# Altium schematic sheet [19] - USB.SchDoc
size A2; DocumentNumber: 19; SheetNumber: 19; SheetTotal: 31
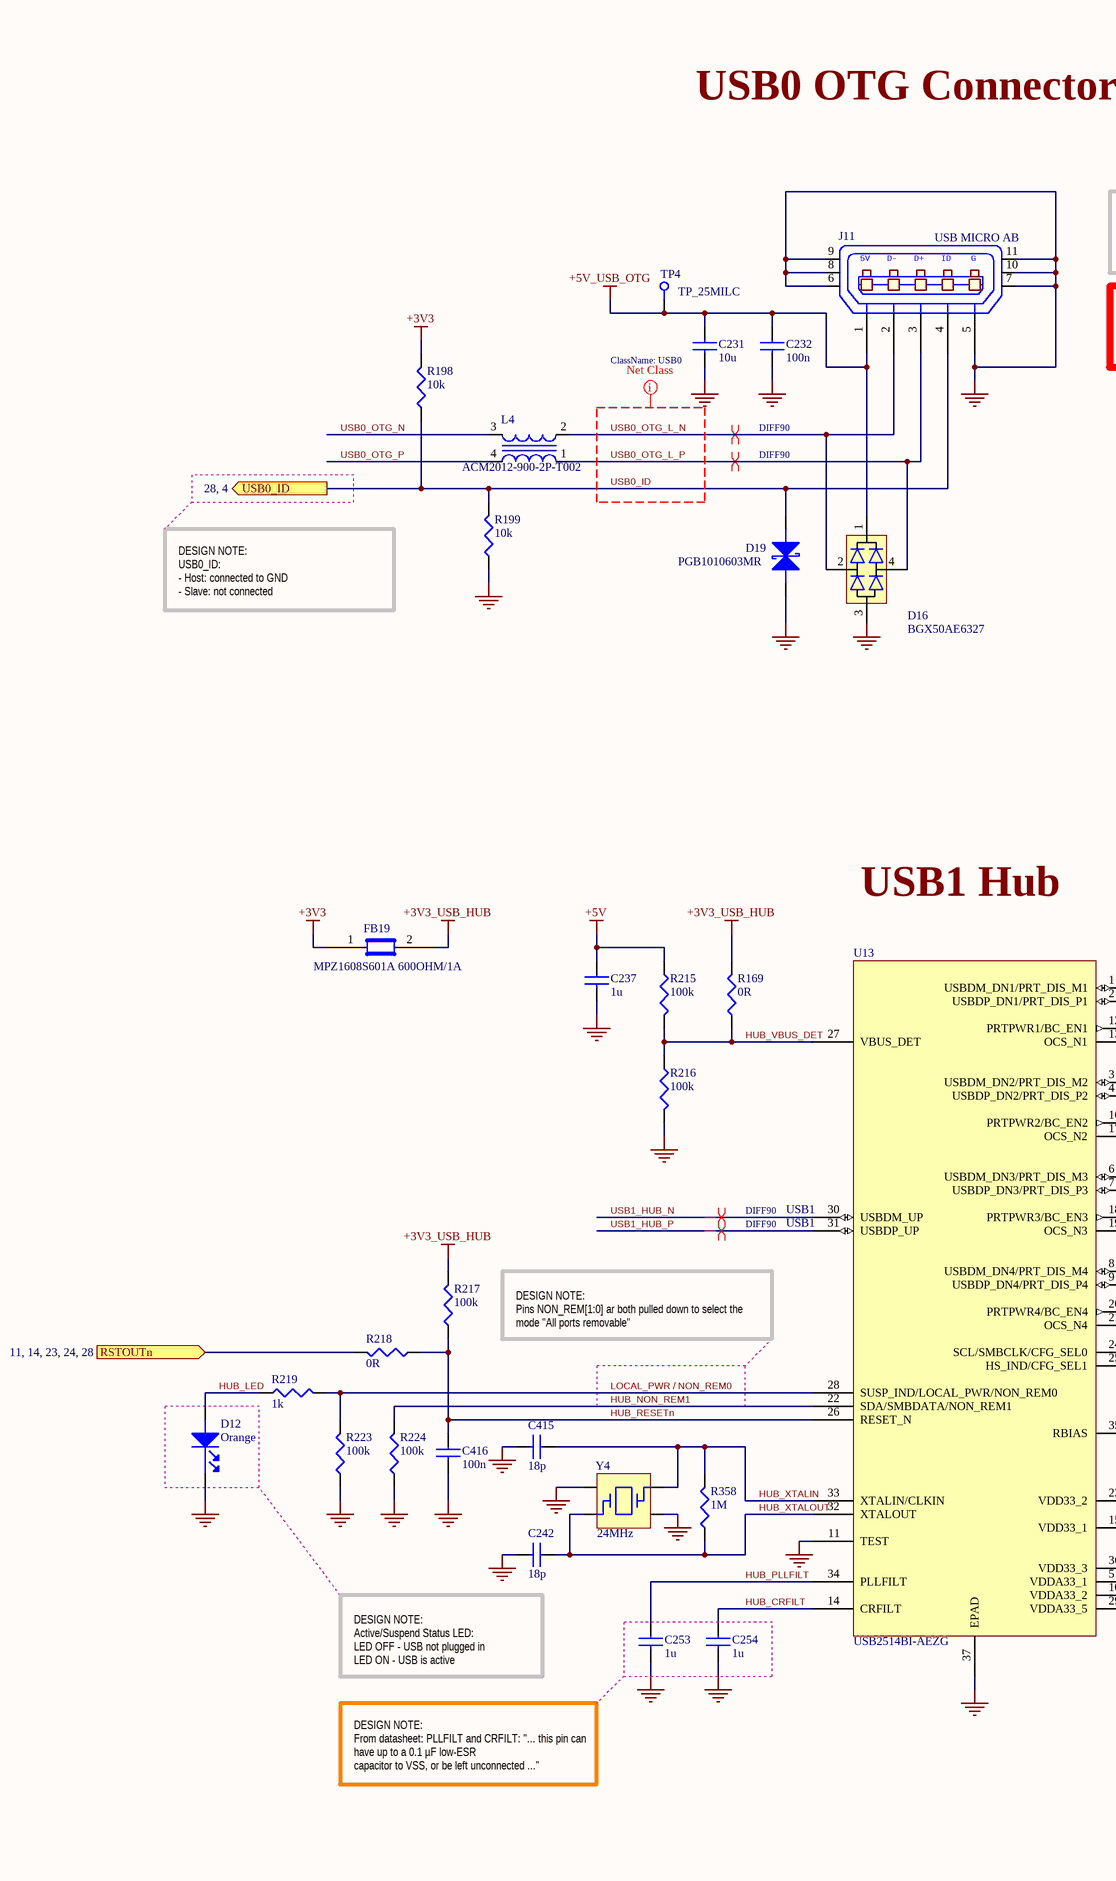
[diagram p0: [19] - USB.SchDoc, left]
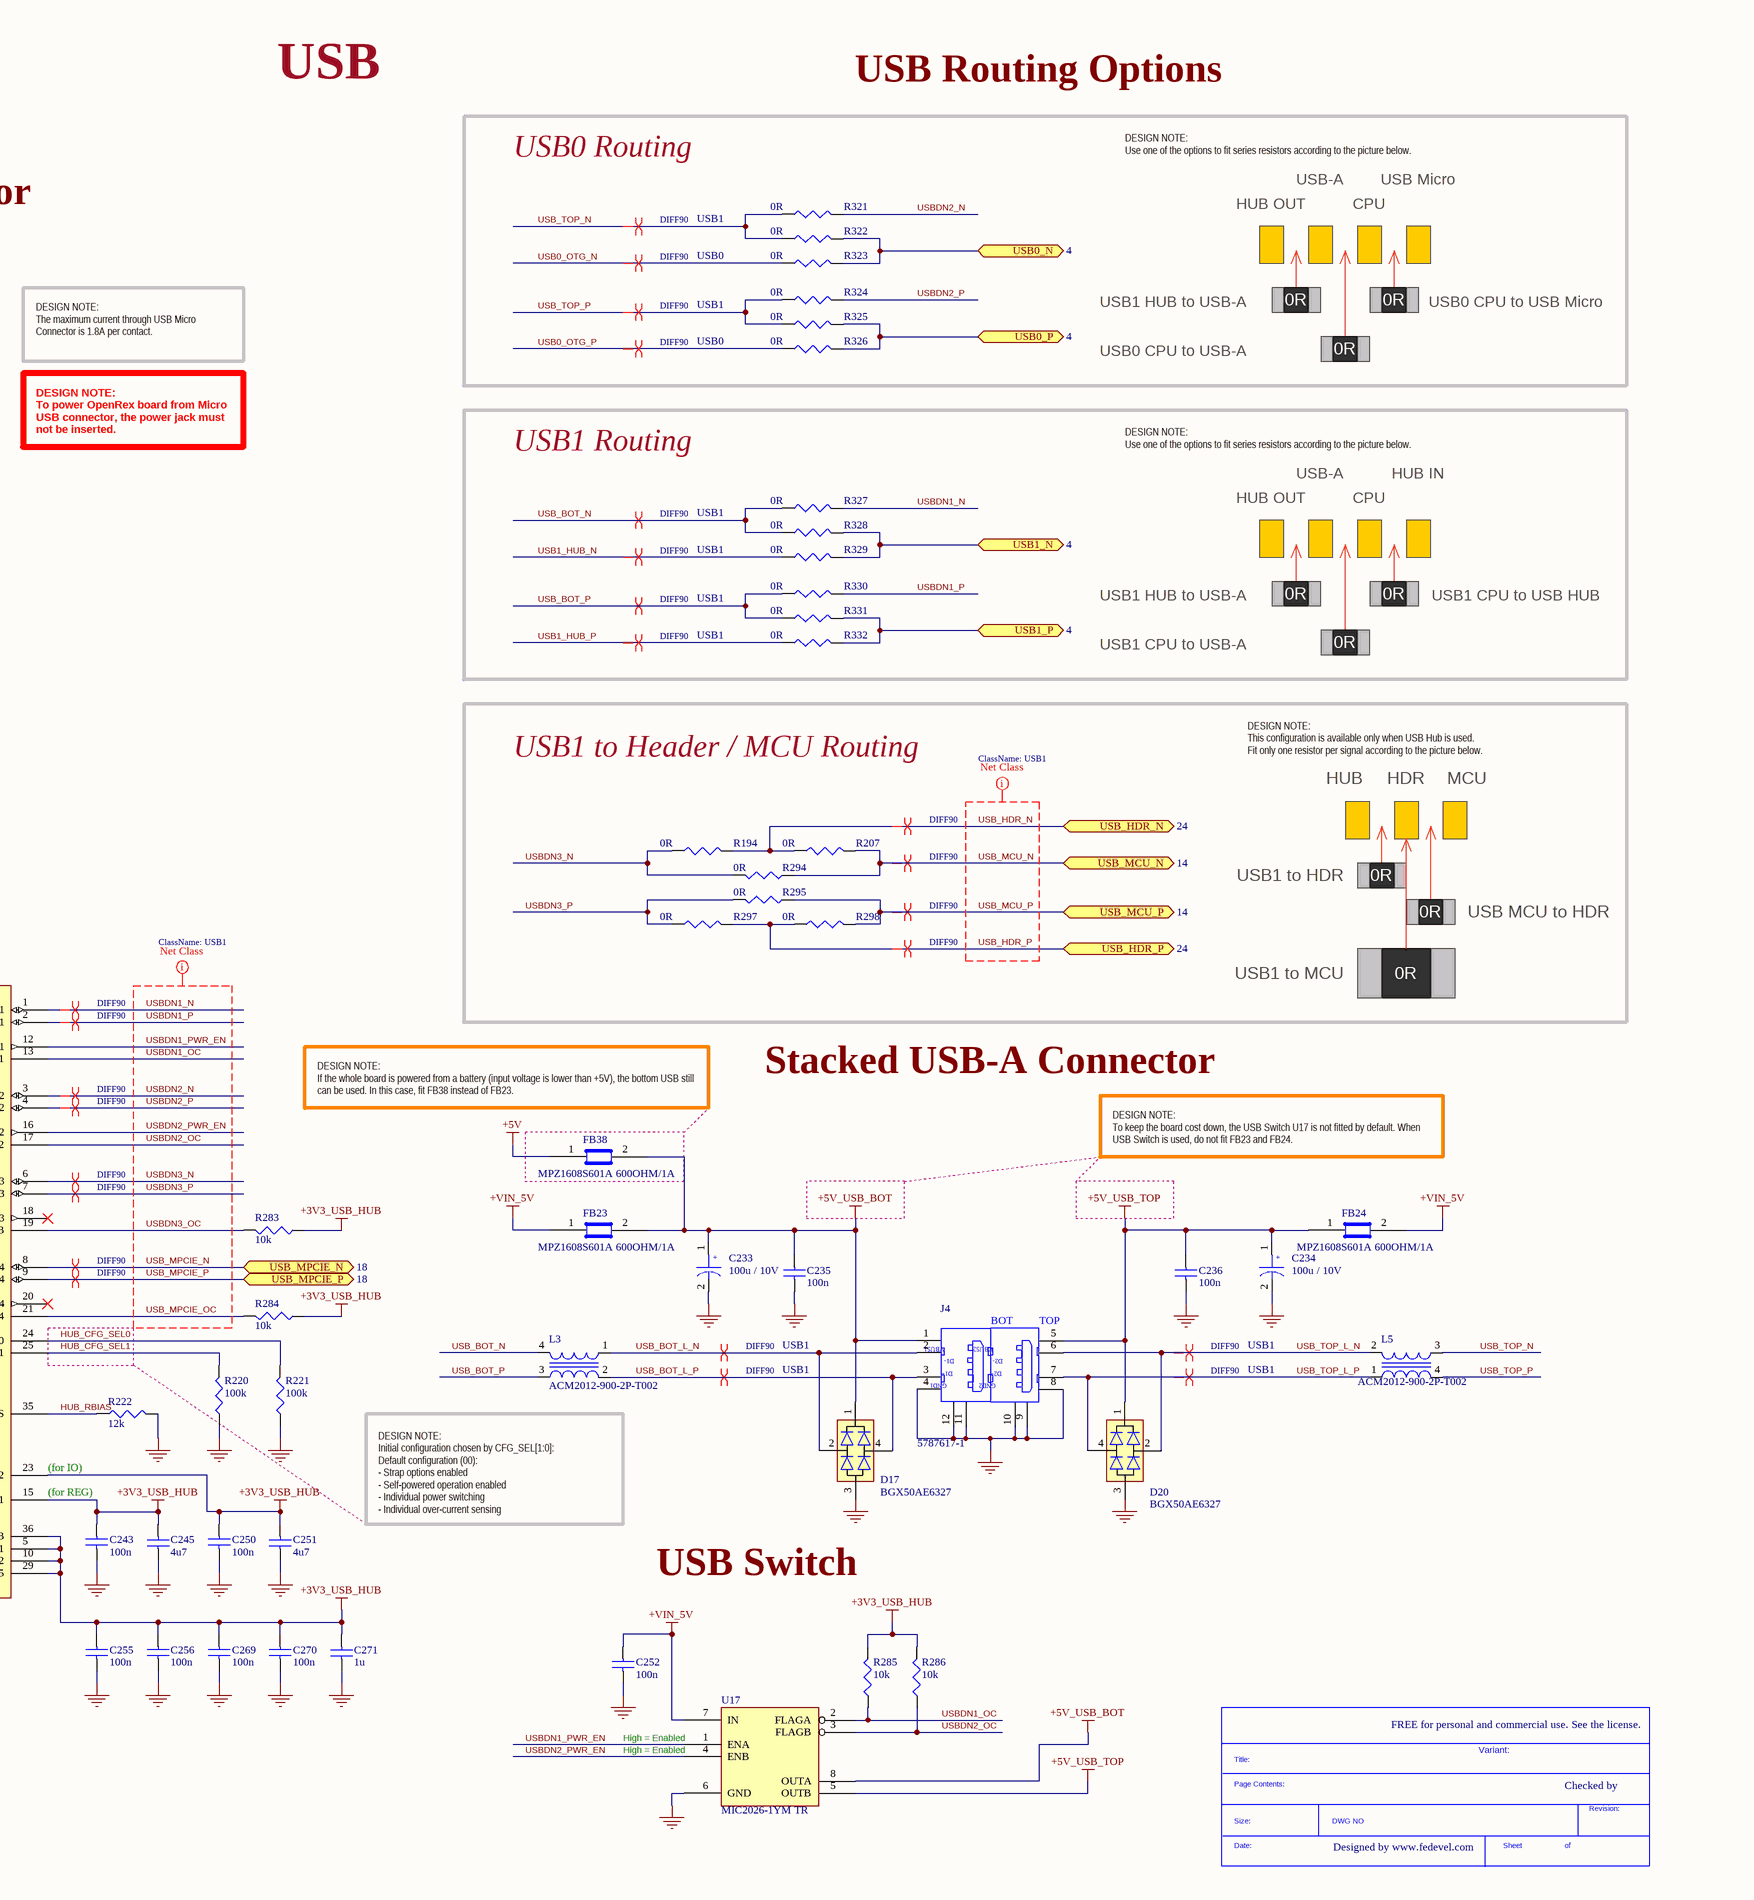
[diagram p1: [19] - USB.SchDoc, right]

## Parts
*  SDTitleBlock  (value not drawn)  (graphical)
C231  10u  [C0603]
C232  100n  [C0402]
C233  100u / 10V  [C2312]
C234  100u / 10V  [C2312]
C235  100n  [C0402]
C236  100n  [C0402]
C237  1u  [C0402]
C242  18p  [C0402]
C243  100n  [C0402]
C245  4u7  [C0402]
C250  100n  [C0402]
C251  4u7  [C0402]
C252  100n  [C0402]
C253  1u  [C0402]
C254  1u  [C0402]
C255  100n  [C0402]
C256  100n  [C0402]
C269  100n  [C0402]
C270  100n  [C0402]
C271  1u  [C0402]
C415  18p  [C0402]
C416  100n  [C0402]
D12  Orange  [LED_0603]
D16  BGX50AE6327  [SOT143]
D17  BGX50AE6327  [SOT143]
D19  PGB1010603MR  [C0603]
D20  BGX50AE6327  [SOT143]
FB19  MPZ1608S601A 600OHM/1A  [C0603]
FB23  MPZ1608S601A 600OHM/1A  [C0603]
FB24  MPZ1608S601A 600OHM/1A  [C0603]
FB38  MPZ1608S601A 600OHM/1A  [C0603]
J4  5787617-1  [USB-2A]
J11  USB MICRO AB  [USB_Micro_AB]
L3  ACM2012-900-2P-T002  [ACM2012]
L4  ACM2012-900-2P-T002  [ACM2012]
L5  ACM2012-900-2P-T002  [ACM2012]
R169  0R  [R0402]
R194  0R  [R0402]
R198  10k  [R0402]
R199  10k  [R0402]
R207  0R  [R0402]
R215  100k  [R0402]
R216  100k  [R0402]
R217  100k  [R0402]
R218  0R  [R0402]
R219  1k  [R0402]
R220  100k  [R0402]
R221  100k  [R0402]
R222  12k  [R0402]
R223  100k  [R0402]
R224  100k  [R0402]
R283  10k  [R0402]
R284  10k  [R0402]
R285  10k  [R0402]
R286  10k  [R0402]
R294  0R  [R0805_small]
R295  0R  [R0805_small]
R297  0R  [R0402]
R298  0R  [R0402]
R321  0R  [R0402]
R322  0R  [R0402]
R323  0R  [R0402]
R324  0R  [R0402]
R325  0R  [R0402]
R326  0R  [R0402]
R327  0R  [R0402]
R328  0R  [R0402]
R329  0R  [R0402]
R330  0R  [R0402]
R331  0R  [R0402]
R332  0R  [R0402]
R358  1M  [R0402]
TP4  TP_25MILC  [TP_25C]  (no BOM)
U13  USB2514BI-AEZG  [QFN36_6mmx6mm]
U17  MIC2026-1YM TR  [8_SOIC_3.9MM]
Y4  24MHz  [ABM8]

## Blocks framed on the sheet
USB0 Routing: R321-R326
USB1 Routing: R327-R332
USB1 to Header / MCU Routing: R194 R207 R294 R295 R297 R298

## Ports
RSTOUTn (see 11, 14, 23, 24, 28), USB0_ID (see 28, 4), USB0_N (bidir, see 4), USB0_P (bidir, see 4), USB1_N (bidir, see 4), USB1_P (bidir, see 4), USB_HDR_N (bidir, see 24), USB_HDR_P (bidir, see 24), USB_MCU_N (bidir, see 14), USB_MCU_P (bidir, see 14), USB_MPCIE_N (bidir, see 18), USB_MPCIE_P (bidir, see 18)

## Nets
+3V3: FB19.1 R198.2
+3V3_USB_HUB: C243.1 C245.2 C250.1 C251.2 C255.1 C256.1 C269.1 C270.1 C271.2 FB19.2 R169.2 R217.2 R283.1 R284.1 R285.2 R286.2 U13.5(VDDA33_1) U13.10(VDDA33_2) U13.15(VDD33_1) U13.23(VDD33_2) U13.29(VDDA33_5) U13.36(VDD33_3)
+5V: C237.1 FB38.1 R215.1
+5V_USB_BOT: C233.1 C235.1 D17.1 FB23.2 FB38.2 J4.1(VBUS) U17.8(OUTA)
+5V_USB_OTG: C231.1 C232.1 D16.1 J11.1(P1) TP4.1
+5V_USB_TOP: C234.1 C236.1 D20.1 FB24.1 J4.5(VBUS2) U17.5(OUTB)
+VIN_5V: C252.1 FB23.1 FB24.2 U17.7(IN)
GND: C231.2 C232.2 C233.2 C234.2 C235.2 C236.2 C237.2 C242.2 C243.2 C245.1 C250.2 C251.1 C252.2 C253.2 C254.2 C255.2 C256.2 C269.2 C270.2 C271.1 C415.2 C416.2 D12.1(cathode) D16.3 D17.3 D19.2 D20.3 J4.4(GND) J4.8(GND) J4.9(SHIELD) J4.10(SHIELD) J4.11(SHIELD) J4.12(SHIELD) J11.5(P5) J11.6 J11.7 J11.8 J11.9 J11.10 J11.11 R199.1 R216.2 R220.1 R221.1 R222.2 R223.1 R224.1 U13.11(TEST) U13.37(EPAD) U17.6(GND) Y4.2 Y4.4
HUB_CFG_SEL0: R221.2 U13.24(SCL/SMBCLK/CFG_SEL0)
HUB_CFG_SEL1: R220.2 U13.25(HS_IND/CFG_SEL1)
HUB_CRFILT: C254.1 U13.14(CRFILT)
HUB_LED: D12.2(ANODE) R219.1
HUB_NON_REM1: R224.2 U13.22(SDA/SMBDATA/NON_REM1)
HUB_PLLFILT: C253.1 U13.34(PLLFILT)
HUB_RBIAS: R222.1 U13.35(RBIAS)
HUB_RESETn: C416.1 R217.1 R218.1 U13.26(RESET_N)
HUB_VBUS_DET: R169.1 R215.2 R216.1 U13.27(VBUS_DET)
HUB_XTALIN: C415.1 R358.2 U13.33(XTALIN/CLKIN) Y4.3
HUB_XTALOUT: C242.1 R358.1 U13.32(XTALOUT) Y4.1
LOCAL_PWR / NON_REM0: R219.2 R223.2 U13.28(SUSP_IND/LOCAL_PWR/NON_REM0)
RSTOUTn: R218.2 ; port RSTOUTn
USB0_ID: D19.1 J11.4(P4) R198.1 R199.2 ; port USB0_ID
USB0_N: R322.2 R323.2 ; port USB0_N
USB0_OTG_L_N: D16.2 J11.2(P2) L4.2
USB0_OTG_L_P: D16.4 J11.3(P3) L4.1
USB0_OTG_N: L4.3 R323.1
USB0_OTG_P: L4.4 R326.1
USB0_P: R325.2 R326.2 ; port USB0_P
USB1_HUB_N: R329.1 U13.30(USBDM_UP)
USB1_HUB_P: R332.1 U13.31(USBDP_UP)
USB1_N: R328.2 R329.2 ; port USB1_N
USB1_P: R331.2 R332.2 ; port USB1_P
USB_BOT_L_N: D17.2 J4.2(D-) L3.1
USB_BOT_L_P: D17.4 J4.3(D+) L3.2
USB_BOT_N: L3.4 R327.1 R328.1
USB_BOT_P: L3.3 R330.1 R331.1
USB_HDR_N: R194.2 R207.1 ; port USB_HDR_N
USB_HDR_P: R297.2 R298.1 ; port USB_HDR_P
USB_MCU_N: R207.2 R294.2 ; port USB_MCU_N
USB_MCU_P: R295.1 R298.2 ; port USB_MCU_P
USB_MPCIE_N: U13.8(USBDM_DN4/PRT_DIS_M4) ; port USB_MPCIE_N
USB_MPCIE_OC: R284.2 U13.21(OCS_N4)
USB_MPCIE_P: U13.9(USBDP_DN4/PRT_DIS_P4) ; port USB_MPCIE_P
USB_TOP_L_N: D20.2 J4.6(D2-) L5.2
USB_TOP_L_P: D20.4 J4.7(D2+) L5.1
USB_TOP_N: L5.3 R321.1 R322.1
USB_TOP_P: L5.4 R324.1 R325.1
USBDN1_N: R327.2 U13.1(USBDM_DN1/PRT_DIS_M1)
USBDN1_OC: R285.1 U13.13(OCS_N1) U17.2(FLAGA)
USBDN1_P: R330.2 U13.2(USBDP_DN1/PRT_DIS_P1)
USBDN1_PWR_EN: U13.12(PRTPWR1/BC_EN1) U17.1(ENA)
USBDN2_N: R321.2 U13.3(USBDM_DN2/PRT_DIS_M2)
USBDN2_OC: R286.1 U13.17(OCS_N2) U17.3(FLAGB)
USBDN2_P: R324.2 U13.4(USBDP_DN2/PRT_DIS_P2)
USBDN2_PWR_EN: U13.16(PRTPWR2/BC_EN2) U17.4(ENB)
USBDN3_N: R194.1 R294.1 U13.6(USBDM_DN3/PRT_DIS_M3)
USBDN3_OC: R283.2 U13.19(OCS_N3)
USBDN3_P: R295.2 R297.1 U13.7(USBDP_DN3/PRT_DIS_P3)

Not connected (* = marked no-connect by the designer): U13 18(PRTPWR3/BC_EN3)* 20(PRTPWR4/BC_EN4)*

## Layout directives
differential pair; net class DIFF90: USB0_OTG_L_N, USB0_OTG_L_P, USB_HDR_N, USB_HDR_P, USB_MCU_N, USB_MCU_P, USB_MPCIE_N, USB_MPCIE_P, USBDN1_N, USBDN1_P, USBDN2_N, USBDN2_P, USBDN3_N, USBDN3_P
net class USB1: USB_HDR_N, USB_HDR_P, USB_MCU_N, USB_MCU_P, USB_MPCIE_N, USB_MPCIE_OC, USB_MPCIE_P, USBDN1_N, USBDN1_OC, USBDN1_P, USBDN1_PWR_EN, USBDN2_N, USBDN2_OC, USBDN2_P, USBDN2_PWR_EN, USBDN3_N, USBDN3_OC, USBDN3_P
net class USB0: USB0_ID, USB0_OTG_L_N, USB0_OTG_L_P
differential pair; net class DIFF90; net class USB1: USB1_HUB_N, USB1_HUB_P, USB_BOT_L_N, USB_BOT_L_P, USB_BOT_N, USB_BOT_P, USB_TOP_L_N, USB_TOP_L_P, USB_TOP_N, USB_TOP_P
differential pair; net class DIFF90; net class USB0: USB0_OTG_N, USB0_OTG_P

## Notes on the sheet
- USB
- USB Routing Options
- USB0 OTG Connector
- DESIGN NOTE:
  Use one of the options to fit series resistors according to the picture below.
- HUB OUT
- USB-A
- CPU
- USB Micro
- USB1 HUB to USB-A
- 0R
- USB0 CPU to USB Micro
- DESIGN NOTE:
  The maximum current through USB Micro Connector is 1.8A per contact.
- USB0 CPU to USB-A
- DESIGN NOTE:
  To power OpenRex board from Micro USB connector, the power jack must not be inserted.
- HUB IN
- USB1 CPU to USB HUB
- DESIGN NOTE:
  USB0_ID:
  - Host: connected to GND
  - Slave: not connected
- USB1 CPU to USB-A
- DESIGN NOTE:
  This configuration is available only when USB Hub is used.
  Fit only one resistor per signal according to the picture below.
- HUB
- HDR
- MCU
- USB1 to HDR
- USB1 Hub
- USB MCU to HDR
- USB1 to MCU
- DESIGN NOTE:
  If the whole board is powered from a battery (input voltage is lower than +5V), the bottom USB still can be used. In this case, fit FB38 instead of FB23.
- Stacked USB-A Connector
- DESIGN NOTE:
  To keep the board cost down, the USB Switch U17 is not fitted by default. When USB Switch is used, do not fit FB23 and FB24.
- DESIGN NOTE:
  Pins NON_REM[1:0] ar both pulled down to select the mode "All ports removable"
- (for IO)
- (for REG)
- DESIGN NOTE:
  Initial configuration chosen by CFG_SEL[1:0]:
  Default configuration (00):
  - Strap options enabled
  - Self-powered operation enabled
  - Individual power switching
  - Individual over-current sensing
- USB Switch
- DESIGN NOTE:
  Active/Suspend Status LED:
  LED OFF - USB not plugged in
  LED ON - USB is active
- DESIGN NOTE:
  From datasheet: PLLFILT and CRFILT: "... this pin can have up to a 0.1 µF low-ESR
  capacitor to VSS, or be left unconnected ..."
- (near U17) High = Enabled
- FREE for personal and commercial use. See the license.
- Variant:
- Checked by
- Designed by www.fedevel.com
- (in symbol 5787617-1_v1.1) BOT; TOP; VBUS1; D1-; D1+; GND1; GND2
- (in symbol 0475890001) 5V; D-; D+; ID; G
- (in symbol SDTitleBlock) Title:; Page Contents:; Revision:; Size:; DWG NO; Date:; Sheet; of
- (in symbol TPSC107K010R0150) +

## Library data of the parts
C231 = C1608X5R0J106M: CAP CER 10UF 6.3V X5R 20% 0603; Manufacturer: TDK Corporation; Capacitance: 10µF; Value: 10µF; .Checked PCB: used; Category: Capacitors; Supplier Part Number: 445-4112-1-ND; Manufacturer Part Number: C1608X5R0J106M; Operating Temperature: -55°C ~ 85°C; Package / Case: 0603 (1608 Metric); Price 1k [$]: 0.08580; .Checked SCH: used; Voltage - Rated: 6.3V; Features: Low ESR; Supplier: Digikey; Supplier 1: Digi-Key; Supplier Part Number 1: 445-4112-1-ND; RoHS: RoHS Compliant; Stock 1: 48157; Pricing 1: 1=0.46, 10=0.363, 100=0.1898, 250=0.14024, 500=0.1089, 1000=0.0858 (USD); Tolerance: ±20%; Temperature Coefficient: X5R; Mounting Type: Surface Mount, MLCC; Applications: General Purpose; Ratings: -; Size / Dimension: 0.063" L x 0.031" W (1.60mm x 0.80mm); Height - Seated (Max): -; Thickness (Max): 0.037" (0.95mm); Lead Spacing: -; Packaging: Cut Tape (CT); Lead Style: -; ComponentLink1URL: http://www.tdk.com/pdf/general_B11.pdf; ComponentLink1Description: http://www.tdk.com/pdf/general_B11.pdf
C232 C235 C236 C243 C250 C252 C255 C256 C269 C270 C416 = C1005X5R1H104K: CAP CER .10UF 50V X5R 10% 0402; Manufacturer: TDK Corporation; Capacitance: 0.1µF; Value: 100nF; .Checked PCB: used; Category: Capacitors; Supplier Part Number: 445-5942-1-ND; Manufacturer Part Number: C1005X5R1H104K; Operating Temperature: -55°C ~ 85°C; Package / Case: 0402 (1005 Metric); Price 1k [$]: 0.02340; .Checked SCH: used; Voltage - Rated: 50V; Supplier: Digikey; Supplier 1: Digi-Key; Supplier Part Number 1: 445-5942-1-ND; RoHS: RoHS Compliant; Stock 1: 106926; Pricing 1: 1=0.27, 10=0.18, 100=0.072, 250=0.05176, 500=0.0369, 1000=0.027 (USD); Tolerance: ±10%; Temperature Coefficient: X5R; Mounting Type: Surface Mount, MLCC; Applications: General Purpose; Ratings: -; Size / Dimension: 0.039" L x 0.020" W (1.00mm x 0.50mm); Height - Seated (Max): -; Thickness (Max): 0.022" (0.55mm); Lead Spacing: -; Features: -; Packaging: Cut Tape (CT); Lead Style: -; ComponentLink1URL: http://www.tdk.co.jp/tefe02/e412_c.pdf; ComponentLink1Description: http://www.tdk.co.jp/tefe02/e412_c.pdf
C233 C234 = TPSC107K010R0150: CAP TANT 100UF 10V 10% 2312; Manufacturer: AVX Corporation; Manufacturer Size Code: C; Capacitance: 100µF; ESR (Equivalent Series Resistance): 150 mOhm; Type: Molded; .Creator: MM; Supplier 1: Digi-Key; Manufacturer Part Number: TPSC107K010R0150; RoHS: RoHS Compliant; Category: Capacitors; Stock 1: 3211; Pricing 1: 1=1, 10=0.85, 100=0.4969, 250=0.4168 (USD); Packaging: Cut Tape (CT); Tolerance: ±10%; Voltage - Rated: 10V; Operating Temperature: -55°C ~ 125°C; Mounting Type: Surface Mount; Package / Case: 2312 (6032 Metric); Size / Dimension: 0.236" L x 0.126" W (6.00mm x 3.20mm); Height - Seated (Max): 0.110" (2.80mm); Lead Spacing: -; Features: General Purpose; Lifetime @ Temp.: -; ComponentLink1URL: http://www.avx.com/docs/Catalogs/tps.pdf; ComponentLink1Description: http://www.avx.com/docs/Catalogs/tps.pdf; Supplier Part Number 1: 478-7995-1-ND; .Checked PCB: MM; .Checked SCH: MM
C237 C253 C254 C271 = C1005X5R1C105K: CAP CER 1.0UF 16V X5R 0402; Manufacturer: TDK Corporation; Capacitance: 1.0µF; Value: 1uF; .Checked PCB: used; Tolerance: ±10%; Category: Capacitors; Supplier Part Number: 445-4978-1-ND; Manufacturer Part Number: C1005X5R1C105K; Operating Temperature: -55°C ~ 85°C; Package / Case: 0402 (1005 Metric); Price 1k [$]: 0.02080; .Checked SCH: used; Voltage - Rated: 16V; Supplier: Digikey; Supplier 1: Digi-Key; Supplier Part Number 1: 445-4978-1-ND; RoHS: RoHS Compliant; Stock 1: 341010; Pricing 1: 1=0.24, 10=0.16, 100=0.064, 250=0.046, 500=0.0328, 1000=0.024 (USD); Temperature Coefficient: X5R; Mounting Type: Surface Mount, MLCC; Applications: General Purpose; Ratings: -; Size / Dimension: 0.039" L x 0.020" W (1.00mm x 0.50mm); Height - Seated (Max): -; Thickness (Max): 0.022" (0.55mm); Lead Spacing: -; Features: -; Packaging: Cut Tape (CT); Lead Style: -; ComponentLink1URL: http://www.tdk.co.jp/tefe02/e412_c.pdf; ComponentLink1Description: http://www.tdk.co.jp/tefe02/e412_c.pdf
C242 C415 = C1005C0G1H180J: CAP CER 18PF 50V C0G 5% 0402; Manufacturer: TDK Corporation; .Checked PCB: used; Temperature Coefficient: C0G, NP0; Capacitance: 18pF; Category: Capacitors; Supplier Part Number: 445-1238-1-ND; Manufacturer Part Number: C1005C0G1H180J; Operating Temperature: -55°C ~ 125°C; Package / Case: 0402 (1005 Metric); Price 1k [$]: 0.00468; Value: 18pF; .Checked SCH: used; Voltage - Rated: 50V; Supplier: Digikey; Supplier 1: Digi-Key; Supplier Part Number 1: 445-1238-1-ND; RoHS: RoHS Compliant; Stock 1: 24321; Pricing 1: 1=0.08, 10=0.05, 100=0.018, 250=0.013, 500=0.0096, 1000=0.0065 (USD); Tolerance: ±5%; Mounting Type: Surface Mount, MLCC; Applications: General Purpose; Ratings: -; Size / Dimension: 0.039" L x 0.020" W (1.00mm x 0.50mm); Height - Seated (Max): -; Thickness (Max): 0.022" (0.55mm); Lead Spacing: -; Features: -; Packaging: Cut Tape (CT); Lead Style: -; ComponentLink1URL: http://www.tdk.co.jp/tefe02/e412_c.pdf; ComponentLink1Description: http://www.tdk.co.jp/tefe02/e412_c.pdf
C245 C251 = C1005X5R1A475M: CAP CER 4.7UF 10V 20% X5R 0402; Manufacturer: TDK Corporation; Capacitance: 4.7µF; .Checked PCB: used; Supplier 1: Digi-Key; Supplier Part Number 1: 445-8023-1-ND; Manufacturer Part Number: C1005X5R1A475M; RoHS: RoHS Compliant; Category: Capacitors; Stock 1: 10140; Pricing 1: 1=0.53, 10=0.415, 100=0.25, 250=0.18752, 500=0.16, 1000=0.125, 5000=0.095 (USD); Voltage - Rated: 10V; Tolerance: ±20%; Temperature Coefficient: X5R; Mounting Type: Surface Mount, MLCC; Operating Temperature: -55°C ~ 85°C; Applications: General Purpose; Ratings: -; Package / Case: 0402 (1005 Metric); Size / Dimension: 0.039" L x 0.020" W (1.00mm x 0.50mm); Height - Seated (Max): -; Thickness (Max): -; Lead Spacing: -; Features: -; Packaging: Cut Tape (CT); Lead Style: -; ComponentLink1URL: http://www.tdk.com/pdf/general_B11.pdf; ComponentLink1Description: http://www.tdk.com/pdf/general_B11.pdf; .Checked SCH: used
D12 = LO L29K-H2K1-24-Z: LED SMARTLED ORANGE 606NM 0603; Manufacturer: OSRAM Opto Semiconductors Inc; Millicandela Rating: 6.3mcd; Voltage - Forward (Vf) Typ: 1.8V; Current - Test: 2mA; Wavelength - Peak: 610nm; Viewing Angle: 160°; Lens Type: Diffused; Lens Style/Size: Rectangle with Flat Top, 1.3mm x 0.8mm; Luminous Flux @ Current - Test: 25 mlm; .Checked PCB: used; Supplier 1: Digi-Key; Supplier Part Number 1: 475-2740-1-ND; Manufacturer Part Number: LO L29K-H2K1-24-Z; RoHS: RoHS Compliant; Category: Optoelectronics; Stock 1: 15900; Pricing 1: 1=0.17, 10=0.141, 100=0.1127, 250=0.0986, 500=0.09016 (USD); Color: Orange; Wavelength - Dominant: 606nm; Package / Case: 0603 (1608 Metric); Size / Dimension: 1.70mm L x 0.80mm W; Height: 0.65mm; Mounting Type: Surface Mount; Packaging: Cut Tape (CT); ComponentLink1URL: http://catalog.osram-os.com/catalogue/catalogue.do;jsessionid=302CF83AF637AE24E40AEB0ADA267EDD?act=downloadFile&favOid=020000010003f9de000100b6; ComponentLink1Description: http://catalog.osram-os.com/catalogue/catalogue.do;jsessionid=302CF83AF637AE24E40AEB0ADA267EDD?act=downloadFile&favOid=020000010003f9de000100b6; .Checked SCH: used
D16 D17 D20 = BGX50AE6327: DIODE SWITCHING 50V SOT-143; Manufacturer: Infineon Technologies; .Checked PCB: used; Current - DC Forward (If): 140mA; Diode Type: Single Phase; Speed: Small Signal =< 200mA (Io), Any Speed; Reverse Recovery Time (trr): 6ns; .Checked SCH: used; Category: Discrete Semiconductor Products; Family: Bridge Rectifiers; Manufacturer Part Number: BGX50AE6327; Package / Case: TO-253-4, TO-253AA; Price 1k [$]: 0.10013; Supplier: Digikey; Supplier Part Number: BGX50AINCT-ND; Value: BGX50AE6327; Supplier 1: Digi-Key; Supplier Part Number 1: BGX50AINCT-ND; RoHS: RoHS Compliant; Stock 1: 438; Pricing 1: 1=0.47, 10=0.334, 100=0.2225, 500=0.12906, 1000=0.10013 (USD); Voltage - Peak Reverse (Max): 50V; Mounting Type: Surface Mount; Packaging: Cut Tape (CT); Supplier Device Package: PG-SOT143-4; ComponentLink1URL: http://www.infineon.com/dgdl/bgx50aseries.pdf?folderId=db3a30431400ef6801141cc1c4cd04e8&fileId=db3a30431400ef6801141cc423c404e9; ComponentLink1Description: http://www.infineon.com/dgdl/bgx50aseries.pdf?folderId=db3a30431400ef6801141cc1c4cd04e8&fileId=db3a30431400ef6801141cc423c404e9
D19 = PGB1010603MR: SUPPRESSOR ESD 24VDC 0603 SMD; Manufacturer: Littelfuse Inc; Voltage - Reverse Standoff (Typ): 24V; Polarization: Bidirectional; .Creator: MM; .Checked PCB: used; Supplier 1: Digi-Key; Manufacturer Part Number: PGB1010603MR; RoHS: RoHS Compliant; Category: Circuit Protection; Stock 1: 155406; Pricing 1: 1=0.66, 10=0.556, 25=0.4872, 100=0.4172, 250=0.3618, 500=0.30646 (USD); Packaging: Cut Tape (CT); Voltage - Breakdown: -; Power (Watts): -; Mounting Type: Surface Mount; Package / Case: 0603 (1608 Metric); Supplier Device Package: 0603 (1608 Metric); ComponentLink1URL: http://www.littelfuse.com/data/en/Data_Sheets/Littelfuse_PulseGuard-ESD_PGB1.pdf; ComponentLink1Description: http://www.littelfuse.com/data/en/Data_Sheets/Littelfuse_PulseGuard-ESD_PGB1.pdf; Supplier Part Number 1: F2594CT-ND; .Checked SCH: used
FB19 FB23 FB24 FB38 = MPZ1608S601A: FERRITE CHIP BEAD 600 OHM SMD 1A; Manufacturer: TDK Corporation; Impedance @ Frequency: 600 Ohm @ 100MHz; DC Resistance (DCR): 150 mOhm Max; Filter Type: Differential Mode - Single; Number of Lines: 1; .Checked PCB: used; Supplier 1: Digi-Key; Supplier Part Number 1: 445-2205-1-ND; Manufacturer Part Number: MPZ1608S601A; RoHS: RoHS Compliant; Category: Filters; Stock 1: 328345; Pricing 1: 1=0.36, 10=0.24, 100=0.096, 250=0.069, 500=0.0492, 1000=0.036 (USD); Current Rating: 1A; Package / Case: 0603 (1608 Metric); Mounting Type: Surface Mount; Packaging: Cut Tape (CT); Height (Max): 0.037" (0.95mm); Size / Dimension: 0.063" L x 0.031" W (1.60mm x 0.80mm); ComponentLink1URL: http://www.tdk.co.jp/tefe02/e9413_mpz.pdf; ComponentLink1Description: http://www.tdk.co.jp/tefe02/e9413_mpz.pdf; .Checked SCH: used
J4 = 5787617-1_v1.1: CONN RCPT R/A 4OVER4POS GOLD PCB; Manufacturer: TE Connectivity; .Checked PCB: used; .Checked SCH: MM; Connector Type: USB - A, Stacked; Number of Contacts: 8; Gender: Receptacle; Specifications: USB 2.0; Category: Connectors, Interconnects; Family: USB, IEEE-1394 (Firewire), DVI, HDMI; Manufacturer Part Number: 5787617-1; Price 1k [$]: 1.68753; Supplier: Digikey; Supplier Part Number: A31728-ND; Value: 5787617-1; Supplier 1: Digi-Key; Supplier Part Number 1: A31728-ND; RoHS: RoHS Compliant; Stock 1: 5401; Pricing 1: 1=3.33, 10=3.197, 25=2.9308, 50=2.7978, 100=2.6645, 250=2.33144, 500=2.26484, 1000=1.93178, 2500=1.79855 (USD); Mounting Type: Through Hole, Right Angle, Horizontal; Features: Board Lock; Packaging: Tray; Ingress Protection: -; ComponentLink1URL: http://documents.tycoelectronics.com/commerce/DocumentDelivery/DDEController?Action=srchrtrv&DocNm=5787617&DocType=CD&DocLang=EN; ComponentLink1Description: http://documents.tycoelectronics.com/commerce/DocumentDelivery/DDEController?Action=srchrtrv&DocNm=5787617&DocType=CD&DocLang=EN; Version: Added pad names into schematic symbol; .Creator: MM
J11 = 0475890001: CONN RCPT MICRO USB AB R/A SMD; Manufacturer: Molex Inc; Connector Type: USB - micro AB; Number of Contacts: 5; Gender: Receptacle; .Creator: MM; .Checked PCB: used; Supplier 1: Digi-Key; Manufacturer Part Number: 0475890001; RoHS: RoHS Compliant; Category: Connectors, Interconnects; Stock 1: 12754; Pricing 1: 1=0.81, 10=0.764, 25=0.6872, 50=0.6108, 100=0.5854, 250=0.53452, 500=0.50908 (USD); Packaging: Cut Tape (CT); Specifications: -; Mounting Type: Surface Mount, Right Angle, Horizontal; Features: Board Guide, Shielded; Ingress Protection: -; ComponentLink1URL: http://www.molex.com/pdm_docs/sd/475890001_sd.pdf; ComponentLink1Description: http://www.molex.com/pdm_docs/sd/475890001_sd.pdf; Supplier Part Number 1: WM17143CT-ND; .Checked SCH: used
L3-L5 = ACM2012-900-2P-T002: CHOKE COMM MODE 90 OHM .4A SMD; Manufacturer: TDK Corporation; Filter Type: Data, Signal Line; Number of Lines: 2; Current: 400mA; DC Resistance (DCR): 190 mOhm Max; Impedance: 90 Ohm; Resistance (Ohms): 8.2K; Power (Watts): 0.063W, 1/16W; Temperature Coefficient: ±100ppm/°C; Tolerance: ±1%; .Checked PCB: used; Supplier 1: Digi-Key; Supplier Part Number 1: 445-2207-1-ND; Manufacturer Part Number: ACM2012-900-2P-T002; RoHS: RoHS Compliant; Category: Filters; Stock 1: 175768; Pricing 1: 1=0.48, 10=0.448, 50=0.42, 100=0.364, 500=0.308, 1000=0.252 (USD); Inductance: -; Mounting Type: Surface Mount; Size / Dimension: 0.079" L x 0.047" W (2.00mm x 1.20mm); Height (Max): 0.051" (1.30mm); Package / Case: 0805 (2012 Metric), 4 Lead; Operating Temperature: -25°C ~ 85°C; Packaging: Cut Tape (CT); ComponentLink1URL: http://www.tdk.co.jp/tefe02/e9719_acm2012.pdf; ComponentLink1Description: http://www.tdk.co.jp/tefe02/e9719_acm2012.pdf; Composition: Thick Film; Features: -; Height: 0.016" (0.40mm); Number of Terminations: 2; ComponentLink2URL: http://www.yageo.com/documents/recent/PYu-RC0402_51_RoHS_L_6.pdf; ComponentLink2Description: http://www.yageo.com/documents/recent/PYu-RC0402_51_RoHS_L_6.pdf; .Checked SCH: used
R169 R194 R207 R218 R297 R298 R321-R332 = RC0402JR-070RL: RES 0.0 OHM 1/16W 0402 SMD; Manufacturer: Yageo; Resistance (Ohms): 0.0; Power (Watts): 0.063W, 1/16W; Tolerance: Jumper; .Checked PCB: used; Category: Resistors; Supplier Part Number: 311-0.0JRCT-ND; Manufacturer Part Number: RC0402JR-070RL; Package / Case: 0402 (1005 Metric); Price 1k [$]: 0.01389; Value: 0R; .Checked SCH: used; Supplier: Digikey; Supplier 1: Digi-Key; Supplier Part Number 1: 311-0.0JRCT-ND; RoHS: RoHS Compliant; Stock 1: 1106330; Pricing 1: 10=0.012, 50=0.009, 100=0.0069, 250=0.00512, 500=0.0038, 1000=0.00253 (USD); Composition: Thick Film; Features: -; Temperature Coefficient: -; Size / Dimension: 0.039" L x 0.020" W (1.00mm x 0.50mm); Height: 0.016" (0.40mm); Number of Terminations: 2; Packaging: Cut Tape (CT); ComponentLink1URL: http://www.yageo.com/documents/recent/PYu-RC0402_51_RoHS_L_6.pdf; ComponentLink1Description: http://www.yageo.com/documents/recent/PYu-RC0402_51_RoHS_L_6.pdf
R198 R199 R283-R286 = RC0402FR-0710KL: RES 10.0K OHM 1/16W 1% 0402 SMD; Manufacturer: Yageo; Power (Watts): 0.063W, 1/16W; .Checked PCB: used; Temperature Coefficient: ±100ppm/°C; Category: Resistors; Supplier Part Number: 311-10.0KLRCT-ND; Manufacturer Part Number: RC0402FR-0710KL; Package / Case: 0402 (1005 Metric); Price 1k [$]: 0.01421; Resistance (Ohms): 10K; Tolerance: ±1%; Value: 10k; .Checked SCH: used; Supplier: Digikey; Supplier 1: Digi-Key; Supplier Part Number 1: 311-10.0KLRCT-ND; RoHS: RoHS Compliant; Stock 1: 2916495; Pricing 1: 10=0.014, 50=0.0104, 100=0.0079, 250=0.00584, 500=0.00432, 1000=0.00288 (USD); Composition: Thick Film; Features: -; Size / Dimension: 0.039" L x 0.020" W (1.00mm x 0.50mm); Height: 0.016" (0.40mm); Number of Terminations: 2; Packaging: Cut Tape (CT); ComponentLink1URL: http://www.yageo.com/documents/recent/PYu-RC0402_51_RoHS_L_6.pdf; ComponentLink1Description: http://www.yageo.com/documents/recent/PYu-RC0402_51_RoHS_L_6.pdf
R215-R217 R220 R221 R223 R224 = RMCF0402FT100K: RES 100K OHM 1/16W 1% 0402 SMD; Manufacturer: Stackpole Electronics Inc; Power (Watts): 0.063W, 1/16W; .Checked PCB: used; Temperature Coefficient: ±100ppm/°C; Category: Resistors; Supplier Part Number: RMCF0402FT100KCT-ND; Manufacturer Part Number: RMCF0402FT100K; Package / Case: 0402 (1005 Metric); Price 1k [$]: 0.00384; Resistance (Ohms): 100K; Tolerance: ±1%; Value: 100k; .Checked SCH: used; Supplier: Digikey; Supplier 1: Digi-Key; Supplier Part Number 1: RMCF0402FT100KCT-ND; RoHS: RoHS Compliant; Stock 1: 95; Pricing 1: 1=0.04, 10=0.025, 50=0.0138, 100=0.0105, 250=0.0078, 500=0.00576, 1000=0.00384 (USD); Composition: Thick Film; Features: -; Size / Dimension: 0.039" L x 0.020" W (1.00mm x 0.50mm); Height: 0.016" (0.40mm); Number of Terminations: 2; Packaging: Cut Tape (CT); ComponentLink1URL: http://www.seielect.com/Catalog/SEI-RMCF.pdf; ComponentLink1Description: http://www.seielect.com/Catalog/SEI-RMCF.pdf
R219 = RC0402FR-071KL: RES 1.00K OHM 1/16W 1% 0402 SMD; Manufacturer: Yageo; Power (Watts): 0.063W, 1/16W; .Checked PCB: used; Temperature Coefficient: ±100ppm/°C; Category: Resistors; Supplier Part Number: 311-1.00KLRCT-ND; Manufacturer Part Number: RC0402FR-071KL; Package / Case: 0402 (1005 Metric); Price 1k [$]: 0.01421; Resistance (Ohms): 1K; Tolerance: ±1%; Value: 1k; .Checked SCH: used; Supplier: Digikey; Supplier 1: Digi-Key; Supplier Part Number 1: 311-1.00KLRCT-ND; RoHS: RoHS Compliant; Stock 1: 1753477; Pricing 1: 10=0.014, 50=0.0104, 100=0.0079, 250=0.00584, 500=0.00432, 1000=0.00288 (USD); Composition: Thick Film; Features: -; Size / Dimension: 0.039" L x 0.020" W (1.00mm x 0.50mm); Height: 0.016" (0.40mm); Number of Terminations: 2; Packaging: Cut Tape (CT); ComponentLink1URL: http://www.yageo.com/documents/recent/PYu-RC0402_51_RoHS_L_6.pdf; ComponentLink1Description: http://www.yageo.com/documents/recent/PYu-RC0402_51_RoHS_L_6.pdf
R222 = RC0402FR-0712KL: RES 12.0K OHM 1/16W 1% 0402 SMD; Manufacturer: Yageo; Power (Watts): 0.063W, 1/16W; .Checked PCB: used; Temperature Coefficient: ±100ppm/°C; Category: Resistors; Supplier Part Number: 311-12.0KLRCT-ND; Manufacturer Part Number: RC0402FR-0712KL; Package / Case: 0402 (1005 Metric); Price 1k [$]: 0.01421; Resistance (Ohms): 12K; Tolerance: ±1%; Value: 12k; .Checked SCH: used; Supplier: Digikey; Supplier 1: Digi-Key; Supplier Part Number 1: 311-12.0KLRCT-ND; RoHS: RoHS Compliant; Stock 1: 526086; Pricing 1: 10=0.014, 50=0.0104, 100=0.0079, 250=0.00584, 500=0.00432, 1000=0.00288 (USD); Composition: Thick Film; Features: -; Size / Dimension: 0.039" L x 0.020" W (1.00mm x 0.50mm); Height: 0.016" (0.40mm); Number of Terminations: 2; Packaging: Cut Tape (CT); ComponentLink1URL: http://www.yageo.com/documents/recent/PYu-RC0402_51_RoHS_L_6.pdf; ComponentLink1Description: http://www.yageo.com/documents/recent/PYu-RC0402_51_RoHS_L_6.pdf
R294 R295 = RC0805JR-070RL_small: RES 0.0 OHM 1/8W 0805 SMD; Manufacturer: Yageo; Resistance (Ohms): 0.0; Power (Watts): 0.125W, 1/8W; Tolerance: Jumper; .Checked PCB: MM; Category: Resistors; Supplier Part Number: 311-0.0ARCT-ND; Manufacturer Part Number: RC0805JR-070RL; Package / Case: 0805 (2012 Metric); Price 1k [$]: 0.01479; Value: 0R; .Checked SCH: MM; Supplier: Digikey; Supplier 1: Digi-Key; Supplier Part Number 1: 311-0.0ARCT-ND; RoHS: RoHS Compliant; Stock 1: 933202; Pricing 1: 10=0.017, 50=0.0126, 100=0.0096, 250=0.00716, 500=0.00528, 1000=0.00352 (USD); Composition: Thick Film; Features: -; Temperature Coefficient: -; Size / Dimension: 0.079" L x 0.049" W (2.00mm x 1.25mm); Height: 0.024" (0.60mm); Number of Terminations: 2; Packaging: Cut Tape (CT); ComponentLink1URL: http://www.yageo.com/documents/recent/PYu-RC0805_51_RoHS_L_4.pdf; ComponentLink1Description: http://www.yageo.com/documents/recent/PYu-RC0805_51_RoHS_L_4.pdf; .Creator: MM
R358 = RC0402FR-071ML: RES 1.00M OHM 1/16W 1% 0402 SMD; Manufacturer: Yageo; Power (Watts): 0.063W, 1/16W; .Checked PCB: used; Temperature Coefficient: ±100ppm/°C; Category: Resistors; Supplier Part Number: 311-1.00MLRCT-ND; Manufacturer Part Number: RC0402FR-071ML; Package / Case: 0402 (1005 Metric); Price 1k [$]: 0.00288; Resistance (Ohms): 1M; Tolerance: ±1%; Value: 1M; .Checked SCH: used; Supplier: Digikey; Supplier 1: Digi-Key; Supplier Part Number 1: 311-1.00MLRCT-ND; RoHS: RoHS Compliant; Stock 1: 102060; Pricing 1: 10=0.014, 50=0.0104, 100=0.0079, 250=0.00584, 500=0.00432, 1000=0.00288 (USD); Composition: Thick Film; Features: -; Size / Dimension: 0.039" L x 0.020" W (1.00mm x 0.50mm); Height: 0.016" (0.40mm); Number of Terminations: 2; Packaging: Cut Tape (CT); ComponentLink1URL: http://www.yageo.com/documents/recent/PYu-RC0402_51_RoHS_L_6.pdf; ComponentLink1Description: http://www.yageo.com/documents/recent/PYu-RC0402_51_RoHS_L_6.pdf
TP4 = TP_25MILC: Test Point 25mil
U13 = USB2514BI-AEZG: USB HUB CONT IND TEMP 36QFNE3; Manufacturer: Microchip Technology; Function: Hub Controller; Standards: USB 2.0; Voltage - Supply: 3 V ~ 3.6 V; Current - Supply: 85mA; .Creator: MM; .Checked PCB: used; Supplier 1: Digi-Key; Manufacturer Part Number: USB2514BI-AEZG; RoHS: RoHS Compliant; Category: Integrated Circuits (ICs); Stock 1: 1662; Pricing 1: 1=3.78, 10=3.26, 25=2.72, 100=2.47 (USD); Packaging: Tube; Protocol: USB; Interface: USB; Operating Temperature: -40°C ~ 85°C; Package / Case: 36-TQFN Exposed Pad; Supplier Device Package: 36-QFN-EP (6x6); ComponentLink1URL: http://www.smsc.com/Downloads/SMSC/Downloads_Public/Data_Sheets/251xb.pdf; ComponentLink1Description: http://www.smsc.com/Downloads/SMSC/Downloads_Public/Data_Sheets/251xb.pdf; Supplier Part Number 1: USB2514BI-AEZG-ND; .Checked SCH: used
U17 = MIC2026-1YM TR: IC SW DISTRIBUTION 2CHAN 8SOIC; Manufacturer: Micrel Inc; .Checked PCB: used; Number of Outputs: 2; Rds (On): 140 mOhm; Internal Switch(s): Yes; Current Limit: 900mA; Voltage - Input: 2.7 V ~ 5.5 V; .Checked SCH: used; Category: Integrated Circuits (ICs); Family: PMIC - Power Distribution Switches; Manufacturer Part Number: MIC2026-1YM TR; Operating Temperature: -40°C ~ 85°C; Package / Case: 8-SOIC (0.154", 3.90mm Width); Price 1k [$]: 0.53200; Supplier: Digikey; Supplier Part Number: 576-1059-1-ND; Value: MIC2026-1YM TR; Supplier 1: Digi-Key; Supplier Part Number 1: 576-1059-1-ND; RoHS: RoHS Compliant; Stock 1: 44857; Pricing 1: 1=1.14, 25=0.95, 100=0.76, 250=0.57, 500=0.532 (USD); Type: High Side Switch; Mounting Type: Surface Mount; Supplier Device Package: 8-SOIC; Packaging: Cut Tape (CT); ComponentLink1URL: http://www.micrel.com/_PDF/mic2026.pdf; ComponentLink1Description: http://www.micrel.com/_PDF/mic2026.pdf
Y4 = ABM8-24.000MHZ-R60-D-1-W-T: CRYSTAL 24MHZ 18PF SMD; Manufacturer: Abracon Corporation; Frequency Stability: ±25ppm; Frequency Tolerance: ±10ppm; ESR (Equivalent Series Resistance): 50 Ohm; Operating Mode: Fundamental; .Creator: MM; Supplier 1: Digi-Key; Manufacturer Part Number: ABM8-24.000MHZ-R60-D-1-W-T; RoHS: RoHS Compliant; Category: Crystals and Oscillators; Stock 1: 11496; Pricing 1: 1=1.42, 10=1.356, 50=1.326, 100=1.134, 500=1.104 (USD); Packaging: Cut Tape (CT); Type: MHz Crystal; Frequency: 24MHz; Load Capacitance: 18pF; Operating Temperature: -40°C ~ 85°C; Ratings: -; Mounting Type: Surface Mount; Package / Case: 4-SMD, No Lead (DFN, LCC); Size / Dimension: 0.126" L x 0.098" W (3.20mm x 2.50mm); Height: 0.031" (0.80mm); ComponentLink1URL: http://www.abracon.com/Resonators/abm8.pdf; ComponentLink1Description: http://www.abracon.com/Resonators/abm8.pdf; Supplier Part Number 1: 535-10155-1-ND; .Checked PCB: MM; .Checked SCH: MM